# EAGLE design minishell (EAGLE 7.4.0)
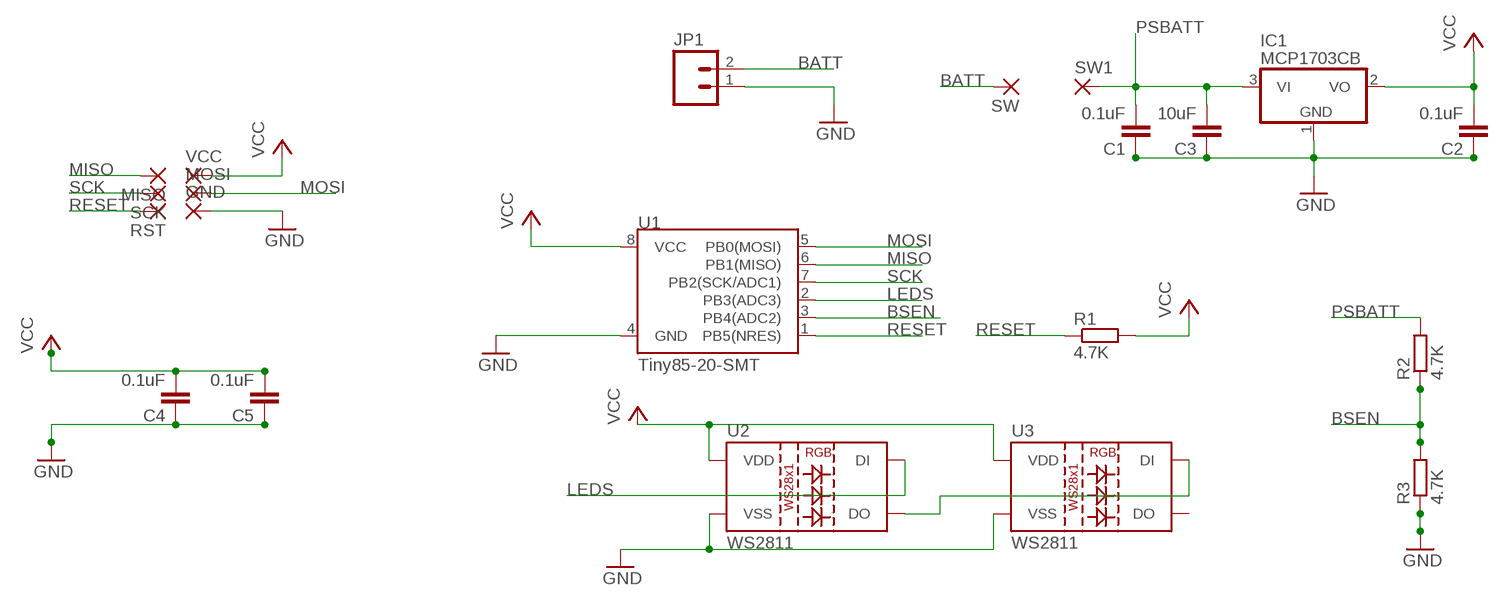
[diagram p0: schematic, sheet 1]

## Parts
C1  0.1uF  C-EUC0603  [C0603]
C2  0.1uF  C-EUC0603  [C0603]
C3  10uF  C-EUC0805  [C0805]
C4  0.1uF  C-EUC0603  [C0603]
C5  0.1uF  C-EUC0603  [C0603]
GND  SMD2  [SMD1,27-2,54]
IC1  MCP1703CB  [SOT23]
JP1  M02PTH  [1X02]
MISO  SMD2  [SMD1,27-2,54]
MOSI  SMD2  [SMD1,27-2,54]
R1  4.7K  R-EU_R0603  [R0603]
R2  4.7K  R-EU_R0603  [R0603]
R3  4.7K  R-EU_R0603  [R0603]
RST  SMD2  [SMD1,27-2,54]
SCK  SMD2  [SMD1,27-2,54]
SW  SMD2  [SMD1,27-2,54]
SW1  SMD2  [SMD1,27-2,54]
U1  Tiny85-20-SMT  ATTINY45TINY85-20-SMT  [SO08-EIAJ]
U2  WS2811  LED-TRICOLOR-5050-ICWS2811  [LED-TRICOLOR-5050-IC]
U3  WS2811  LED-TRICOLOR-5050-ICWS2811  [LED-TRICOLOR-5050-IC]
VCC  SMD2  [SMD1,27-2,54]

## Nets
BATT: JP1.2 SW.1(P)
BSEN: R2.1 R3.2 U1.3(PB4(ADC2))
GND: C1.1 C2.1 C3.1 C4.1 C5.1 GND.1(P) IC1.1(GND) JP1.1 R3.1 U1.4(GND) U2.6(VSS) U3.6(VSS)
LEDS: U1.2(PB3(ADC3)) U2.2(DI)
MISO: MISO.1(P) U1.6(PB1(MISO))
MOSI: MOSI.1(P) U1.5(PB0(MOSI))
N$1: U2.1(DO) U3.2(DI)
PSBATT: C1.2 C3.2 IC1.3(VI) R2.2 SW1.1(P)
RESET: R1.1 RST.1(P) U1.1(PB5(NRES))
SCK: SCK.1(P) U1.7(PB2(SCK/ADC1))
VCC: C2.2 C4.2 C5.2 IC1.2(VO) R1.2 U1.8(VCC) U2.3(VDD) U2.5(VDD) U3.3(VDD) U3.5(VDD) VCC.1(P)
Unconnected: U3.1(DO)

## Library data of the parts
C1-C5 = resistor:C-EU: CAPACITOR, European symbol
GND MISO MOSI RST SCK SW SW1 VCC = wirepad:SMD2: SMD PAD
IC1 = linear:MCP1703: 250 mA, 16V, Low Quiescent Current LDO Regulator Source: http://ww1.microchip.com/downloads/en/DeviceDoc/22049b.pdf
JP1 = SparkFun-Connectors:M02: Standard 2-pin 0.1" header. Use with - straight break away headers ( PRT-00116) - right angle break away headers (PRT-00553) - swiss pins (PRT-00743) - machine pins (PRT-00117) - female headers (PRT-00115) Molex polarized connector foot print use with: PRT-08233 with associated crimp pins and housings. 2.54_SCREWTERM for use with PRT-10571. 3.5mm Screw Terminal footprints for PRT-08084 5mm Screw Terminal footprints for use with PRT-08432
R1-R3 = resistor:R-EU_: RESISTOR, European symbol
U1 = SparkFun-DigitalIC:ATTINY45: Atmel 8-pin 2/4/8kB flash uC; PROD_ID: IC-09092
U2 U3 = SparkFun-LED:LED-TRICOLOR-5050-IC: WS2812 RGB LED w/ WS2811 driver 5x5mm SMD LED with built-in controller IC. DIO-11598; PROD_ID: DIO-11598

## Net classes
0 default: clearance 0.205 mm

## Board
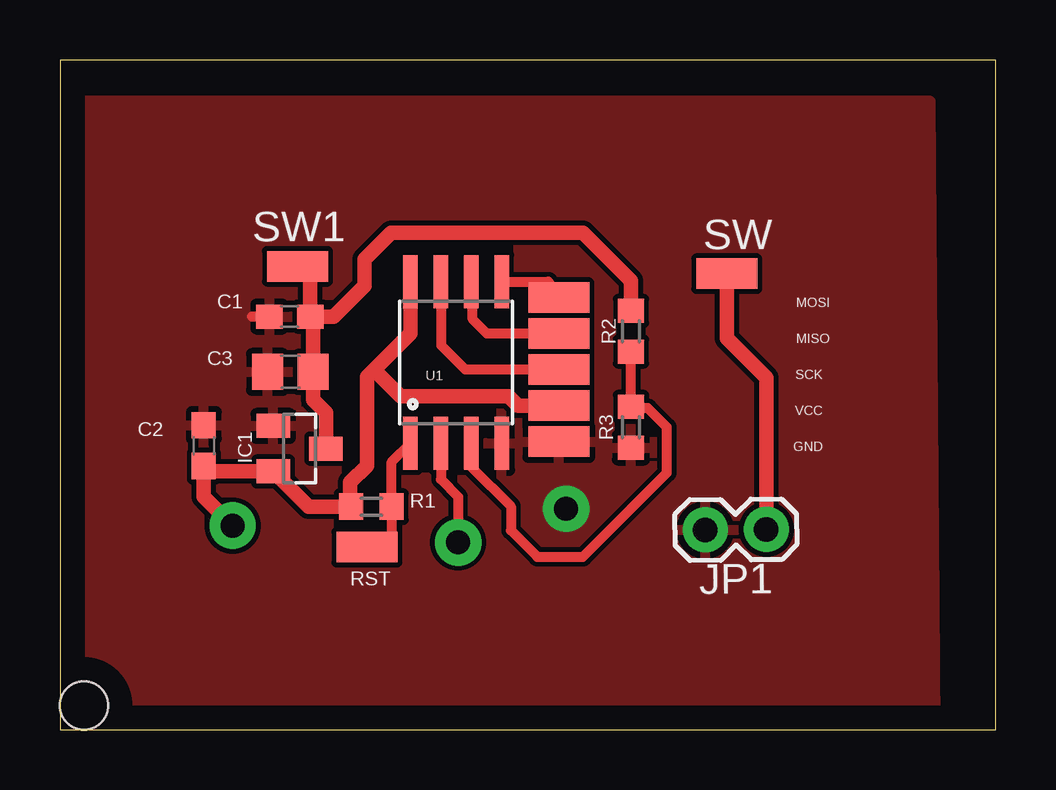
[diagram p1: board, top side]
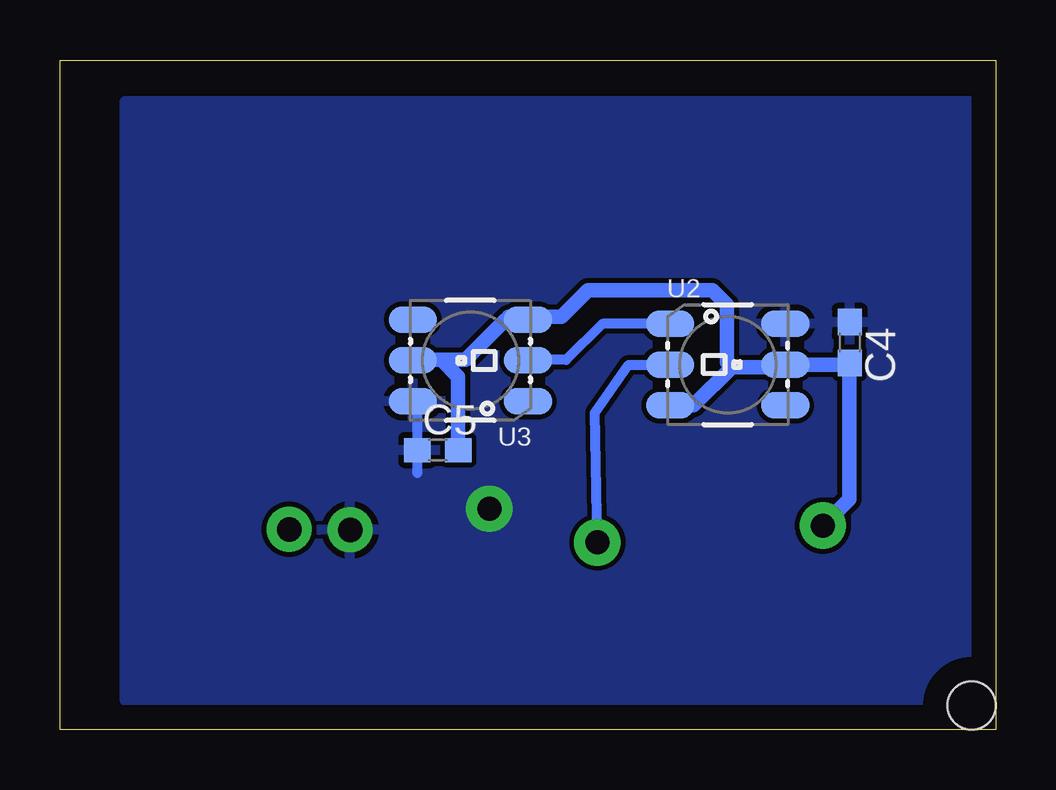
[diagram p2: board, bottom side, seen from below]

Size 39 x 27.9 mm. Coordinates in mm from the lower left corner, seen from the top.
Outline: 0,0 39,0 39,27.9 0,27.9 0,0
Copper layers (1*16): Top 0.035mm / dielectric 1.5mm / Bottom 0.035mm
Design rules "default": minimum track width 10mil, minimum drill 24mil, track to track 8mil, track to pad 8mil, pad to pad 8mil, via to via 8mil, smd to smd 8mil, copper to edge 40mil, drill to drill 8mil, minimum pad ring 10mil, minimum via ring 8mil, stop-mask expansion 4mil, vias tented up to drill 0mil, thermal gap 10mil
Holes 2 mm at 1,1 1,44 59,1 59,44

### Footprints (pad centres in the part's own frame; a part is rotated, then mirrored left to right if it is on the bottom)
C0603 = smd 1.1 x 1: 1 -0.85,0; 2 0.85,0
C0805 = smd 1.3 x 1.5: 1 -0.95,0; 2 0.95,0
SMD1,27-2,54 = smd 1.27 x 2.54: 1 0,0
SOT23 = smd 1 x 1.4: 1 -0.95,-1.1; 2 0.95,-1.1; 3 0,1.1
1X02 = drill 1.016 pad 1.88: 1 0,0; 2 2.54,0
R0603 = smd 1 x 1.1: 1 -0.85,0; 2 0.85,0
SO08-EIAJ = smd 0.61 x 2.21: 1 -1.905,-3.378; 2 -0.635,-3.378; 3 0.635,-3.378; 4 1.905,-3.378; 5 1.905,3.353; 6 0.635,3.353; 7 -0.635,3.353; 8 -1.905,3.353
LED-TRICOLOR-5050-IC = smd 2 x 1.1: 1 -2.4,1.7; 2 -2.4,0; 3 -2.4,-1.7; 4 2.4,-1.7; 5 2.4,0; 6 2.4,1.7

### Placement (x,y rotation side)
C1  9.58,17.21 0 top
C2  5.99,11.83 270 top
C3  9.6,14.91 0 top
C4  6.08,16.13 270 bottom
C5  23.25,11.65 0 bottom
GND  20.8,12 90 top
IC1  9.99,11.71 270 top
JP1  26.9,8.32 0.5 top
MISO  20.8,16.5 90 top
MOSI  20.8,18 90 top
R1  12.98,9.29 180 top
R2  23.8,16.6 90 top
R3  23.8,12.6 90 top
RST  12.8,7.6 270 top
SCK  20.8,15 90 top
SW  27.8,19 270 top
SW1  9.9,19.3 90 top
U1  16.51,15.31 0 top
U2  11.16,15.21 0 bottom
U3  21.89,15.38 180 bottom
VCC  20.8,13.5 90 top

### Tracks (layer width: path | path; a pad name or v marks a point on that pad's centre or on a via)
BATT
  Top 0.61: JP1.2 29.44,14.66 27.8,16.3 SW.1
BSEN
  Top 0.406: R2.1 R3.2 23.85,13.4 24.5,13.4 25.3,12.6 25.3,10.7 21.8,7.2 19.9,7.2 18.8,8.3 18.8,9.3 17.14,10.96 U1.3
GND  (via drill 1 pad 1.93)
  Top 0.406: C1.1 7.99,17.21
  Bottom 0.406: U3.6 24.1,13.49 C5.1 24.1,10.7
  other vias: 21.1,9.2
  pour Top: 0,0 36.5,0.1 36.3,26.2 0,26.2
  pour Bottom: 1.1,1.2 36.3,1.2 36.3,26.2 1.1,26.2
LEDS  (via drill 1 pad 1.93)
  Top 0.406: U1.2 15.88,10.43 16.6,9.7 v16.6,7.8
  Bottom 0.406: v16.6,7.8 16.7,13.2 15.3,15.2 U2.2
MISO
  Top 0.406: MISO.1 17.8,16.5 17.2,17.1 17.2,18.61 U1.6
MOSI
  Top 0.406: U1.5 20.36,18.66 MOSI.1
N$1
  Bottom 0.406: U2.1 16.39,16.91 17.9,15.4 19.47,15.4 U3.2
PSBATT
  Top 0.61: IC1.3 11.1,13.2 10.55,13.75 C3.2 10.55,17.09 C1.2 | C1.2 10.43,18.77 SW1.1 | C1.2 11.41,17.21 12.7,18.5 12.7,19.6 13.8,20.7 21.8,20.7 23.8,18.7 R2.2
RESET
  Top 0.406: U1.1 13.83,11.16 R1.1 13.83,7.93 13.5,7.6 RST.1
SCK
  Top 0.406: SCK.1 16.9,15 15.9,16 15.9,18.64 U1.7
VCC  (via drill 1 pad 1.93)
  Top 0.406: 5.99,10.76 C2.2
  Top 0.61: 5.99,10.76 IC1.2 10.36,9.29 R1.2 12.1,9.32 12.1,10.3 12.8,11 12.8,14.7 13.1,15 | C2.2 5.99,9.71 v7.2,8.5 | U1.8 14.61,16.5 13.1,15 | VCC.1 19.1,13.5 18.7,13.9 14.2,13.9 13.1,15
  Bottom 0.406: 6.15,15.21 C4.2 6.1,15.26 | U2.3 12.59,13.51 | 8.87,15.1 U2.5 | U3.3 20.42,17.08 20.3,17.2 | 24.27,15.4 U3.5 23.08,15.38 | 11.2,15.3 11,15.1
  Bottom 0.61: U2.5 6.15,15.21 | v7.2,8.5 6.1,9.6 6.1,15.26 | 12.59,13.51 11,15.1 8.87,15.1 | 20.42,17.08 22.1,15.4 24.27,15.4 | 20.3,17.2 18.1,17.2 17,18.3 11.8,18.3 11.2,17.7 11.2,15.3 | 23.08,15.38 22.4,14.7 C5.2